# EAGLE design TinyS3Controller (EAGLE 9.6.2)
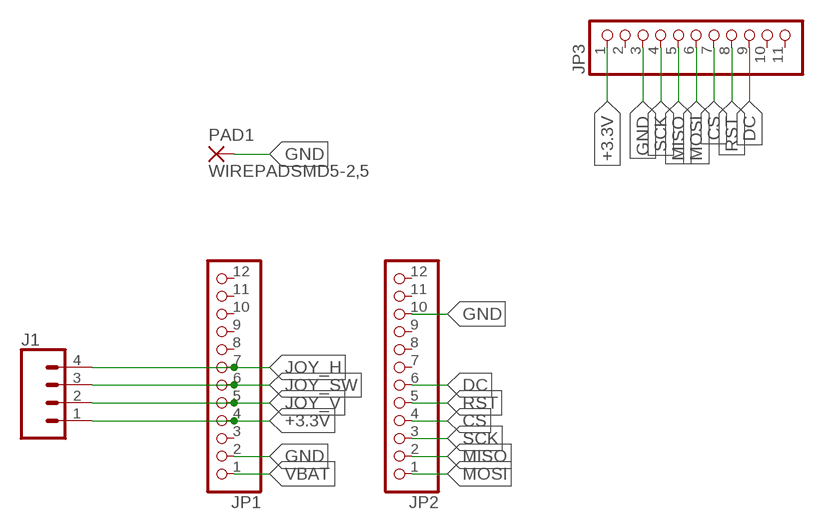
[diagram p0: schematic, sheet 1]

## Parts
J1  CONN_04PTH  [1X04]
JP1  PINHD-1X12-CB  [1X12-CB]
JP2  PINHD-1X12-CB  [1X12-CB]
JP3  PINHD-1X11  [1X11]
PAD1  WIREPADSMD5-2,5  [5-2,5]

## Nets
+3.3V: J1.1 JP1.4 JP3.1
CS: JP2.4 JP3.7
DC: JP2.6 JP3.9
GND: JP1.2 JP2.10 JP3.3 PAD1.1(P)
JOY_H: J1.4 JP1.7
JOY_SW: J1.3 JP1.6
JOY_V: J1.2 JP1.5
MISO: JP2.2 JP3.5
MOSI: JP2.1 JP3.6
RST: JP2.5 JP3.8
SCK: JP2.3 JP3.4
VBAT: JP1.1
Unconnected: JP1.3 JP1.8 JP1.9 JP1.10 JP1.11 JP1.12 JP2.7 JP2.8 JP2.9 JP2.11 JP2.12 JP3.2 JP3.10 JP3.11

## Library data of the parts
J1 = SparkFun-Connectors:CONN_04: Multi connection point. Often used as Generic Header-pin footprint for 0.1 inch spaced/style header connections On any of the 0.1 inch spaced packages, you can populate with these: Break Away Headers - Straight <https://www.sparkfun.com/products/116> (PRT-00116) Break Away Male Headers - Right Angle <https://www.sparkfun.com/products/553> (PRT-00553) Female Headers <https://www.sparkfun.com/products/115> (PRT-00115) Break Away Headers - Machine Pin <https://www.sparkfun.com/products/117> (PRT-00117) Break Away Female Headers - Swiss Machine Pin <https://www.sparkfun.com/products/743> (PRT-00743) For SCREWTERMINALS and SPRING TERMINALS visit here: Screw Terimnals on SparkFun.com <https://www.sparkfun.com/search/results?term=Screw+Terminals> (5mm/3.5mm/2.54mm spacing) This device is also useful as a general connection point to wire up your design to another part of your project. Our various solder wires solder well into these plated through hole pads. Hook-Up Wire - Assortment (Stranded, 22 AWG) <https://www.sparkfun.com/products/11375> (PRT-11375) Hook-Up Wire - Assortment (Solid Core, 22 AWG) <https://www.sparkfun.com/products/11367> (PRT-11367) View the entire wire category on our website here <https://www.sparkfun.com/categories/141> Special notes: Molex polarized connector foot print use with SKU : PRT-08231 with associated crimp pins and housings. 1MM SMD Version SKU: PRT-10208; PROD_ID: CONN-09696
JP1 JP2 = adafruit:PINHD-1X12: PIN HEADER
JP3 = pinhead:PINHD-1X11: PIN HEADER
PAD1 = wirepad:WIREPAD: Wire PAD connect wire on PCB

## Board
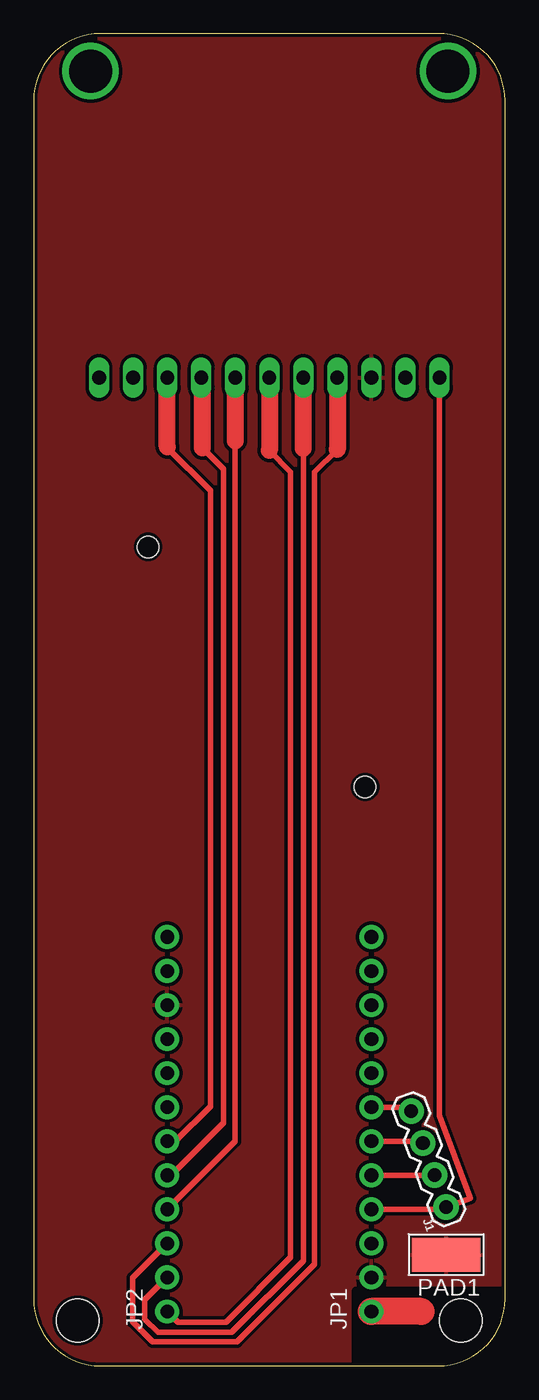
[diagram p1: board, top side]
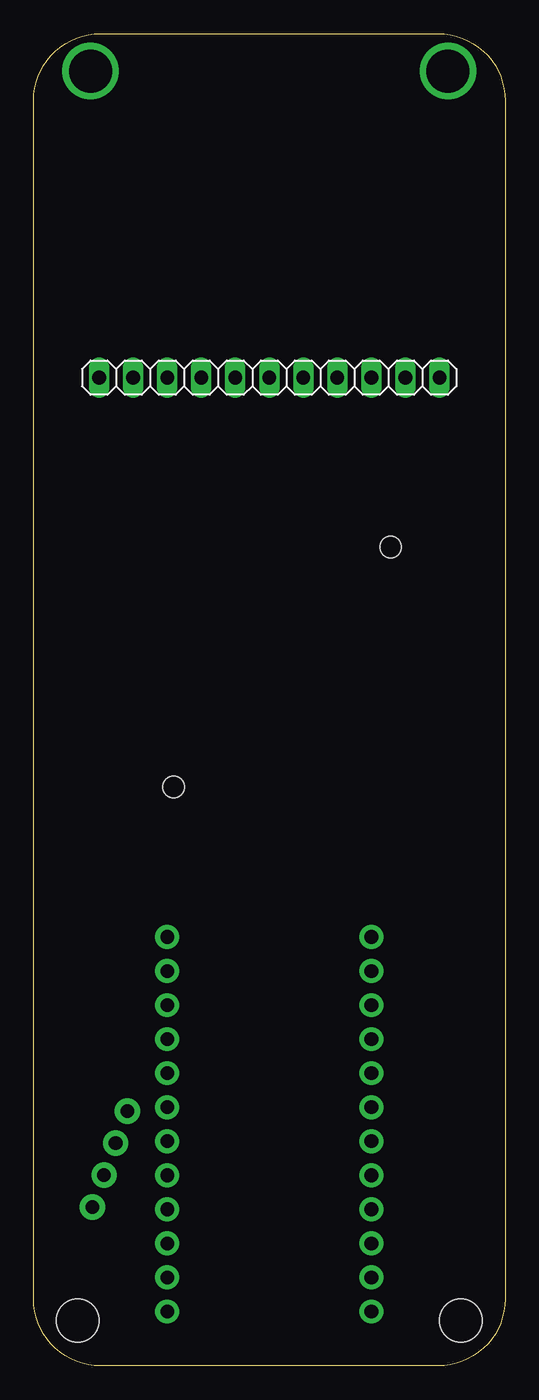
[diagram p2: board, bottom side, seen from below]

Size 35.2 x 99.4 mm. Coordinates in mm from the lower left corner, seen from the top.
Outline: 0,94.4 0,5 arc90 5,0 30.2,0 arc90 35.2,5 35.2,94.4 arc90 30.2,99.4 5,99.4 arc90 0,94.4
Copper layers (1*16): Top 0.035mm / dielectric 1.5mm / Bottom 0.035mm
Design rules "default *": minimum track width 6mil, minimum drill 0.35mm, track to track 6mil, track to pad 6mil, pad to pad 6mil, via to via 6mil, smd to smd 6mil, copper to edge 6mil, drill to drill 6mil, minimum pad ring 10mil, minimum via ring 8mil, stop-mask expansion 4mil, vias tented up to drill 0mil, thermal gap 10mil
Holes 3.2 mm at 3.3,3.4 31.9,3.4
Holes 1.6 mm at 24.75,43.2 8.55,61.1
tRestrict: 4 lines

### Footprints (pad centres in the part's own frame; a part is rotated, then mirrored left to right if it is on the bottom)
1X04 = drill 1.016 pad 1.88: 1 0,0; 2 2.54,0; 3 5.08,0; 4 7.62,0
1X12-CB = drill 1.016 pad 1.778: 1 -13.97,0; 2 -11.43,0; 3 -8.89,0; 4 -6.35,0; 5 -3.81,0; 6 -1.27,0; 7 1.27,0; 8 3.81,0; 9 6.35,0; 10 8.89,0; 11 11.43,0; 12 13.97,0
1X11 = drill 1.016 long: 1 -12.7,0; 2 -10.16,0; 3 -7.62,0; 4 -5.08,0; 5 -2.54,0; 6 0,0; 7 2.54,0; 8 5.08,0; 9 7.62,0; 10 10.16,0; 11 12.7,0
5-2,5 = smd 2.54 x 5.08: 1 0,0

### Placement (x,y rotation side)
J1  30.8,11.85 110 top
JP1  25.22,18.03 90 top
JP2  9.98,18.03 90 top
JP3  17.6,73.73 0 bottom
PAD1  30.8,8.3 90 top

### Tracks (layer width: path | path; a pad name or v marks a point on that pad's centre or on a via)
+3.3V
  Top 0.406: JP1.4 30.64,11.68 J1.1 32.6,12.5 30.3,18.7 JP3.1
CS
  Top 0.406: JP2.4 15.06,16.76 15.06,69
  Top 1.27: JP3.7 15.06,69
DC
  Top 0.406: JP2.6 10.58,16.76 13.2,19.38 13.2,65.3 9.98,68.52 9.98,68.58
  Top 1.27: 9.98,68.58 JP3.9
GND
  pour Top (isolate 0.254, rank 2): 30.8,0 4.4,0 arc-90 0,4.4 0,94.4 arc-90 5,99.4 30.2,99.4 arc-90 35.2,94.4 35.2,4.4 arc-90
JOY_H
  Top 0.406: J1.4 27.9,19.3 JP1.7
JOY_SW
  Top 0.406: JP1.6 28.92,16.76 J1.3
JOY_V
  Top 0.406: JP1.5 J1.2
MISO
  Top 0.406: JP2.2 8.3,4.92 8.3,3.5 9.3,2.5 14.8,2.5 20.14,7.84 20.14,68.46
  Top 1.27: 20.14,68.46 JP3.5
MOSI
  Top 0.406: JP2.1 10.78,3.26 14.36,3.26 19.2,8.1 19.2,66.7 17.6,68.3
  Top 1.27: JP3.6 17.6,68.3
N$2  (via drill 3.2)
  other vias: 4.27,96.59
N$3  (via drill 3.2)
  other vias: 30.94,96.59
RST
  Top 0.406: JP2.5 10.28,14.22 14.2,18.14 14.2,66.9 12.6,68.5
  Top 1.27: JP3.8 12.6,73.65 12.6,68.5
SCK
  Top 0.406: JP2.3 7.4,6.56 7.4,3.3 8.9,1.8 15.2,1.8 20.98,7.58 20.98,66.68 22.68,68.38
  Top 1.27: JP3.4 22.68,68.38
VBAT
  Top 2: 28.95,4.06 JP1.1